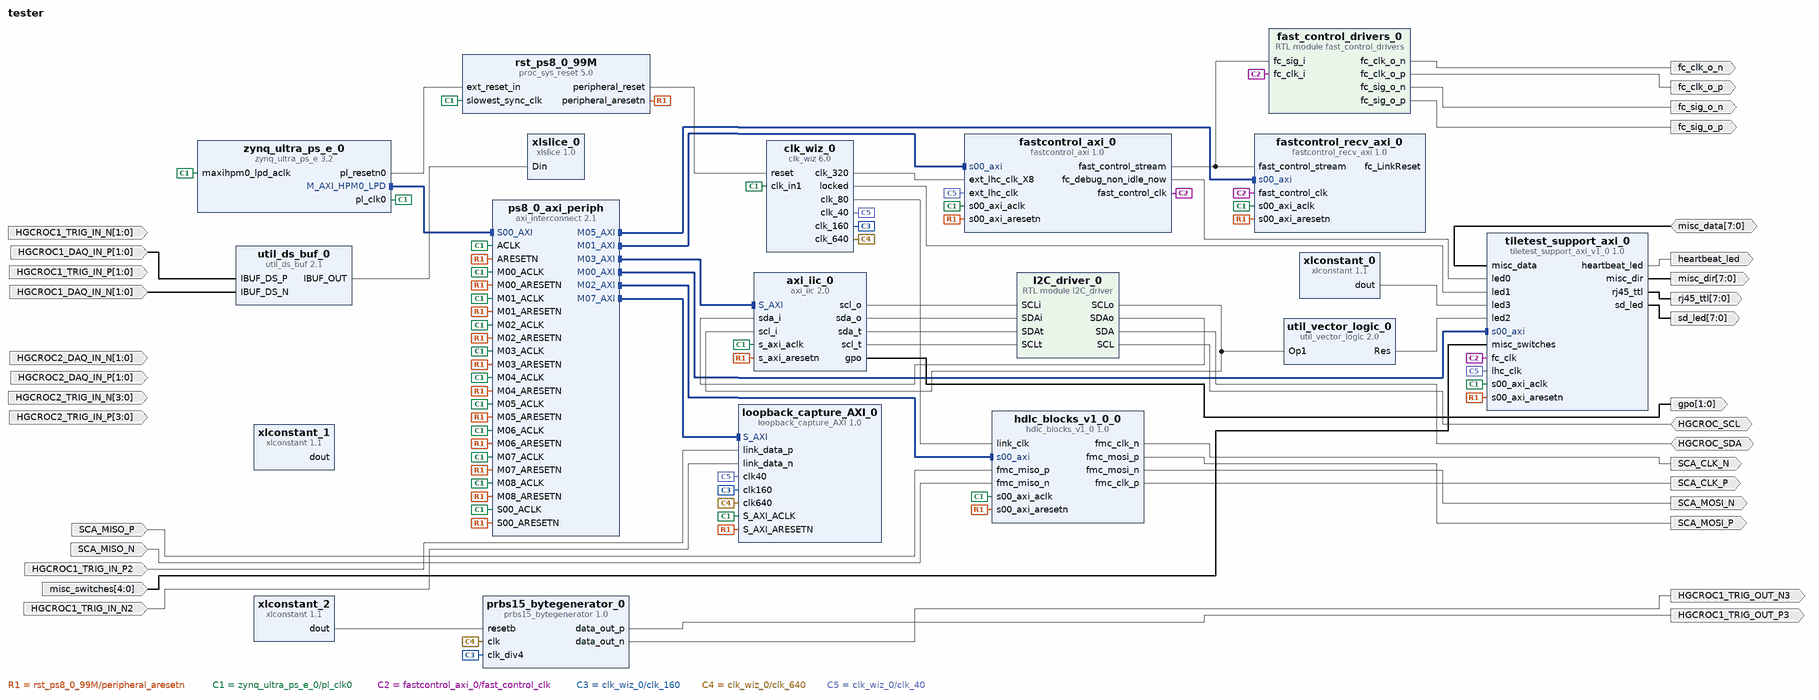
[diagram p0: block diagram of the top level]
# Vivado block design tester, xczu2cg-sfvc784-1-e, Vivado 2018.3
create_bd_design tester

create_bd_port -dir O fc_clk_o_p
create_bd_port -dir O fc_clk_o_n
create_bd_port -dir O fc_sig_o_p
create_bd_port -dir O fc_sig_o_n
create_bd_port -dir O -from 7 -to 0 sd_led
create_bd_port -dir O -from 7 -to 0 misc_dir
create_bd_port -dir IO -from 7 -to 0 misc_data
create_bd_port -dir O -from 7 -to 0 rj45_ttl
create_bd_port -dir O heartbeat_led
create_bd_port -dir I -from 4 -to 0 misc_switches
create_bd_port -dir I SCA_MISO_P
create_bd_port -dir I SCA_MISO_N
create_bd_port -dir O SCA_MOSI_P
create_bd_port -dir O SCA_MOSI_N
create_bd_port -dir O -type clk SCA_CLK_P
create_bd_port -dir O -type clk SCA_CLK_N
create_bd_port -dir IO HGCROC_SDA
create_bd_port -dir O -from 1 -to 0 gpo
create_bd_port -dir IO HGCROC_SCL
create_bd_port -dir I -from 1 -to 0 HGCROC1_DAQ_IN_P
create_bd_port -dir I -from 1 -to 0 HGCROC1_DAQ_IN_N
create_bd_port -dir I HGCROC1_TRIG_IN_P2
create_bd_port -dir I HGCROC1_TRIG_IN_N2
create_bd_port -dir O HGCROC1_TRIG_OUT_P3
create_bd_port -dir O HGCROC1_TRIG_OUT_N3
create_bd_port -dir I -from 1 -to 0 HGCROC1_TRIG_IN_P
create_bd_port -dir I -from 1 -to 0 HGCROC1_TRIG_IN_N
create_bd_port -dir I -from 1 -to 0 HGCROC2_DAQ_IN_P
create_bd_port -dir I -from 1 -to 0 HGCROC2_DAQ_IN_N
create_bd_port -dir I -from 3 -to 0 HGCROC2_TRIG_IN_P
create_bd_port -dir I -from 3 -to 0 HGCROC2_TRIG_IN_N

create_bd_cell -type ip -vlnv xilinx.com:ip:zynq_ultra_ps_e:3.2 zynq_ultra_ps_e_0
set_property -dict [list \
  CONFIG.PSU_BANK_0_IO_STANDARD LVCMOS18 \
  CONFIG.PSU_BANK_1_IO_STANDARD LVCMOS33 \
  CONFIG.PSU_BANK_2_IO_STANDARD LVCMOS18 \
  CONFIG.PSU_BANK_3_IO_STANDARD LVCMOS18 \
  CONFIG.PSU__CRF_APB__DDR_CTRL__FREQMHZ 1200 \
  CONFIG.PSU__CRF_APB__DDR_CTRL__SRCSEL DPLL \
  CONFIG.PSU__CRL_APB__USB3__ENABLE 1 \
  CONFIG.PSU__DDRC__BUS_WIDTH {32 Bit} \
  CONFIG.PSU__DDRC__COMPONENTS Components \
  CONFIG.PSU__DDRC__DEVICE_CAPACITY {8192 MBits} \
  CONFIG.PSU__DDRC__DRAM_WIDTH {16 Bits} \
  CONFIG.PSU__DDRC__ECC Disabled \
  CONFIG.PSU__DDRC__MEMORY_TYPE {DDR 4} \
  CONFIG.PSU__DDRC__SPEED_BIN DDR4_2400P \
  CONFIG.PSU__DDR_HIGH_ADDRESS_GUI_ENABLE 0 \
  CONFIG.PSU__DDR__INTERFACE__FREQMHZ 600.000 \
  CONFIG.PSU__DLL__ISUSED 1 \
  CONFIG.PSU__ENET3__FIFO__ENABLE 0 \
  CONFIG.PSU__ENET3__GRP_MDIO__ENABLE 1 \
  CONFIG.PSU__ENET3__GRP_MDIO__IO {MIO 76 .. 77} \
  CONFIG.PSU__ENET3__PERIPHERAL__ENABLE 1 \
  CONFIG.PSU__ENET3__PERIPHERAL__IO {MIO 64 .. 75} \
  CONFIG.PSU__ENET3__PTP__ENABLE 0 \
  CONFIG.PSU__ENET3__TSU__ENABLE 0 \
  CONFIG.PSU__GEM3_COHERENCY 0 \
  CONFIG.PSU__GEM__TSU__ENABLE 0 \
  CONFIG.PSU__GPIO0_MIO__IO {MIO 0 .. 25} \
  CONFIG.PSU__GPIO0_MIO__PERIPHERAL__ENABLE 1 \
  CONFIG.PSU__I2C0__PERIPHERAL__ENABLE 1 \
  CONFIG.PSU__I2C0__PERIPHERAL__IO {MIO 38 .. 39} \
  CONFIG.PSU__PRESET_APPLIED 1 \
  CONFIG.PSU__PSS_REF_CLK__FREQMHZ 33.33333 \
  CONFIG.PSU__QSPI_COHERENCY 0 \
  CONFIG.PSU__QSPI__GRP_FBCLK__ENABLE 1 \
  CONFIG.PSU__QSPI__GRP_FBCLK__IO {MIO 6} \
  CONFIG.PSU__QSPI__PERIPHERAL__DATA_MODE x4 \
  CONFIG.PSU__QSPI__PERIPHERAL__ENABLE 1 \
  CONFIG.PSU__QSPI__PERIPHERAL__IO {MIO 0 .. 12} \
  CONFIG.PSU__QSPI__PERIPHERAL__MODE {Dual Parallel} \
  CONFIG.PSU__SD0__DATA_TRANSFER_MODE 8Bit \
  CONFIG.PSU__SD0__GRP_POW__ENABLE 1 \
  CONFIG.PSU__SD0__GRP_POW__IO {MIO 23} \
  CONFIG.PSU__SD0__PERIPHERAL__ENABLE 1 \
  CONFIG.PSU__SD0__PERIPHERAL__IO {MIO 13 .. 22} \
  CONFIG.PSU__SD0__RESET__ENABLE 1 \
  CONFIG.PSU__SD0__SLOT_TYPE eMMC \
  CONFIG.PSU__SD1_COHERENCY 0 \
  CONFIG.PSU__SD1__DATA_TRANSFER_MODE 4Bit \
  CONFIG.PSU__SD1__GRP_CD__ENABLE 0 \
  CONFIG.PSU__SD1__GRP_POW__ENABLE 0 \
  CONFIG.PSU__SD1__GRP_WP__ENABLE 0 \
  CONFIG.PSU__SD1__PERIPHERAL__ENABLE 1 \
  CONFIG.PSU__SD1__PERIPHERAL__IO {MIO 46 .. 51} \
  CONFIG.PSU__SD1__SLOT_TYPE {SD 2.0} \
  CONFIG.PSU__SWDT0__CLOCK__ENABLE 0 \
  CONFIG.PSU__SWDT0__PERIPHERAL__ENABLE 1 \
  CONFIG.PSU__SWDT0__RESET__ENABLE 0 \
  CONFIG.PSU__SWDT1__CLOCK__ENABLE 0 \
  CONFIG.PSU__SWDT1__PERIPHERAL__ENABLE 1 \
  CONFIG.PSU__SWDT1__RESET__ENABLE 0 \
  CONFIG.PSU__TSU__BUFG_PORT_PAIR 0 \
  CONFIG.PSU__TTC0__CLOCK__ENABLE 0 \
  CONFIG.PSU__TTC0__PERIPHERAL__ENABLE 1 \
  CONFIG.PSU__TTC0__WAVEOUT__ENABLE 0 \
  CONFIG.PSU__TTC1__CLOCK__ENABLE 0 \
  CONFIG.PSU__TTC1__PERIPHERAL__ENABLE 1 \
  CONFIG.PSU__TTC1__WAVEOUT__ENABLE 0 \
  CONFIG.PSU__TTC2__CLOCK__ENABLE 0 \
  CONFIG.PSU__TTC2__PERIPHERAL__ENABLE 1 \
  CONFIG.PSU__TTC2__WAVEOUT__ENABLE 0 \
  CONFIG.PSU__TTC3__CLOCK__ENABLE 0 \
  CONFIG.PSU__TTC3__PERIPHERAL__ENABLE 1 \
  CONFIG.PSU__TTC3__WAVEOUT__ENABLE 0 \
  CONFIG.PSU__UART0__BAUD_RATE 115200 \
  CONFIG.PSU__UART0__MODEM__ENABLE 0 \
  CONFIG.PSU__UART0__PERIPHERAL__ENABLE 1 \
  CONFIG.PSU__UART0__PERIPHERAL__IO {MIO 30 .. 31} \
  CONFIG.PSU__USB0_COHERENCY 0 \
  CONFIG.PSU__USB0__PERIPHERAL__ENABLE 1 \
  CONFIG.PSU__USB0__PERIPHERAL__IO {MIO 52 .. 63} \
  CONFIG.PSU__USB0__REF_CLK_FREQ 100 \
  CONFIG.PSU__USB0__REF_CLK_SEL {Ref Clk3} \
  CONFIG.PSU__USB2_0__EMIO__ENABLE 0 \
  CONFIG.PSU__USB3_0__EMIO__ENABLE 0 \
  CONFIG.PSU__USB3_0__PERIPHERAL__ENABLE 1 \
  CONFIG.PSU__USB3_0__PERIPHERAL__IO {GT Lane0} \
  CONFIG.PSU__USB__RESET__MODE {Boot Pin} \
  CONFIG.PSU__USB__RESET__POLARITY {Active Low} \
  CONFIG.SUBPRESET1 Custom \
] [get_bd_cells zynq_ultra_ps_e_0]
# 86 more settings of zynq_ultra_ps_e_0 are not shown: defaults, MIO pin electricals, DDR timing, and values the tool derives
create_bd_cell -type ip -vlnv xilinx.com:ip:axi_interconnect:2.1 ps8_0_axi_periph
set_property -dict {CONFIG.NUM_MI 9} [get_bd_cells ps8_0_axi_periph]
create_bd_cell -type ip -vlnv xilinx.com:ip:xlconstant:1.1 xlconstant_0
set_property -dict {CONFIG.CONST_VAL 0} [get_bd_cells xlconstant_0]
create_bd_cell -type module -reference fast_control_drivers fast_control_drivers_0
create_bd_cell -type ip -vlnv xilinx.com:ip:util_vector_logic:2.0 util_vector_logic_0
set_property -dict {CONFIG.C_OPERATION not CONFIG.C_SIZE 1} [get_bd_cells util_vector_logic_0]
create_bd_cell -type module -reference I2C_driver I2C_driver_0
create_bd_cell -type ip -vlnv xilinx.com:ip:axi_iic:2.0 axi_iic_0
set_property -dict {CONFIG.C_DEFAULT_VALUE 0x03 CONFIG.C_GPO_WIDTH 2} [get_bd_cells axi_iic_0]
create_bd_cell -type ip -vlnv xilinx.com:ip:clk_wiz:6.0 clk_wiz_0
set_property -dict [list \
  CONFIG.CLKOUT1_JITTER 161.073 \
  CONFIG.CLKOUT1_PHASE_ERROR 320.727 \
  CONFIG.CLKOUT1_REQUESTED_OUT_FREQ 320 \
  CONFIG.CLKOUT2_JITTER 212.577 \
  CONFIG.CLKOUT2_PHASE_ERROR 320.727 \
  CONFIG.CLKOUT2_REQUESTED_OUT_FREQ 40 \
  CONFIG.CLKOUT2_USED true \
  CONFIG.CLKOUT3_JITTER 193.445 \
  CONFIG.CLKOUT3_PHASE_ERROR 320.727 \
  CONFIG.CLKOUT3_REQUESTED_OUT_FREQ 80 \
  CONFIG.CLKOUT3_USED true \
  CONFIG.CLKOUT4_JITTER 176.430 \
  CONFIG.CLKOUT4_PHASE_ERROR 320.727 \
  CONFIG.CLKOUT4_REQUESTED_OUT_FREQ 160 \
  CONFIG.CLKOUT4_USED true \
  CONFIG.CLKOUT5_JITTER 147.227 \
  CONFIG.CLKOUT5_PHASE_ERROR 320.727 \
  CONFIG.CLKOUT5_REQUESTED_OUT_FREQ 640 \
  CONFIG.CLKOUT5_USED true \
  CONFIG.CLK_OUT1_PORT clk_320 \
  CONFIG.CLK_OUT2_PORT clk_40 \
  CONFIG.CLK_OUT3_PORT clk_80 \
  CONFIG.CLK_OUT4_PORT clk_160 \
  CONFIG.CLK_OUT5_PORT clk_640 \
  CONFIG.MMCM_CLKFBOUT_MULT_F 64.000 \
  CONFIG.MMCM_CLKIN1_PERIOD 10.000 \
  CONFIG.MMCM_CLKIN2_PERIOD 10.000 \
  CONFIG.MMCM_CLKOUT0_DIVIDE_F 4.000 \
  CONFIG.MMCM_CLKOUT1_DIVIDE 32 \
  CONFIG.MMCM_CLKOUT2_DIVIDE 16 \
  CONFIG.MMCM_CLKOUT3_DIVIDE 8 \
  CONFIG.MMCM_CLKOUT4_DIVIDE 2 \
  CONFIG.MMCM_DIVCLK_DIVIDE 5 \
  CONFIG.NUM_OUT_CLKS 5 \
] [get_bd_cells clk_wiz_0]
create_bd_cell -type ip -vlnv xilinx.com:ip:proc_sys_reset:5.0 rst_ps8_0_99M
create_bd_cell -type ip -vlnv xilinx.com:ip:util_ds_buf:2.1 util_ds_buf_0
set_property -dict {CONFIG.C_SIZE 2} [get_bd_cells util_ds_buf_0]
create_bd_cell -type ip -vlnv xilinx.com:user:hdlc_blocks_v1_0:1.0 hdlc_blocks_v1_0_0
create_bd_cell -type ip -vlnv xilinx.com:user:tiletest_support_axi_v1_0:1.0 tiletest_support_axi_0
create_bd_cell -type ip -vlnv xilinx.com:user:fastcontrol_axi:1.0 fastcontrol_axi_0
create_bd_cell -type ip -vlnv xilinx.com:ip:xlconstant:1.1 xlconstant_1
set_property -dict {CONFIG.CONST_VAL 0} [get_bd_cells xlconstant_1]
create_bd_cell -type ip -vlnv xilinx.com:ip:xlslice:1.0 xlslice_0
set_property -dict {CONFIG.DIN_FROM 0 CONFIG.DIN_TO 0 CONFIG.DIN_WIDTH 2} [get_bd_cells xlslice_0]
create_bd_cell -type ip -vlnv xilinx.com:user:fastcontrol_recv_axi:1.0 fastcontrol_recv_axi_0
create_bd_cell -type ip -vlnv user.org:user:prbs15_bytegenerator:1.0 prbs15_bytegenerator_0
create_bd_cell -type ip -vlnv xilinx.com:ip:xlconstant:1.1 xlconstant_2
create_bd_cell -type ip -vlnv user.org:user:loopback_capture_AXI:1.0 loopback_capture_AXI_0

# ---- connections ----

connect_bd_intf_net [get_bd_intf_pins ps8_0_axi_periph/M02_AXI] [get_bd_intf_pins hdlc_blocks_v1_0_0/s00_axi]
connect_bd_intf_net [get_bd_intf_pins ps8_0_axi_periph/M03_AXI] [get_bd_intf_pins axi_iic_0/S_AXI]
connect_bd_intf_net [get_bd_intf_pins ps8_0_axi_periph/M01_AXI] [get_bd_intf_pins fastcontrol_axi_0/s00_axi]
connect_bd_intf_net [get_bd_intf_pins ps8_0_axi_periph/M07_AXI] [get_bd_intf_pins loopback_capture_AXI_0/S_AXI]
connect_bd_intf_net [get_bd_intf_pins ps8_0_axi_periph/M05_AXI] [get_bd_intf_pins fastcontrol_recv_axi_0/s00_axi]
connect_bd_intf_net [get_bd_intf_pins ps8_0_axi_periph/M00_AXI] [get_bd_intf_pins tiletest_support_axi_0/s00_axi]
connect_bd_intf_net [get_bd_intf_pins zynq_ultra_ps_e_0/M_AXI_HPM0_LPD] [get_bd_intf_pins ps8_0_axi_periph/S00_AXI]
connect_bd_net [get_bd_pins zynq_ultra_ps_e_0/pl_resetn0] [get_bd_pins rst_ps8_0_99M/ext_reset_in]
connect_bd_net [get_bd_pins rst_ps8_0_99M/peripheral_aresetn] \
  [get_bd_pins ps8_0_axi_periph/S00_ARESETN] [get_bd_pins ps8_0_axi_periph/M00_ARESETN] \
  [get_bd_pins ps8_0_axi_periph/ARESETN] [get_bd_pins ps8_0_axi_periph/M01_ARESETN] \
  [get_bd_pins ps8_0_axi_periph/M02_ARESETN] [get_bd_pins ps8_0_axi_periph/M03_ARESETN] [get_bd_pins axi_iic_0/s_axi_aresetn] \
  [get_bd_pins hdlc_blocks_v1_0_0/s00_axi_aresetn] [get_bd_pins tiletest_support_axi_0/s00_axi_aresetn] \
  [get_bd_pins fastcontrol_axi_0/s00_axi_aresetn] [get_bd_pins ps8_0_axi_periph/M04_ARESETN] \
  [get_bd_pins ps8_0_axi_periph/M05_ARESETN] [get_bd_pins ps8_0_axi_periph/M06_ARESETN] \
  [get_bd_pins fastcontrol_recv_axi_0/s00_axi_aresetn] [get_bd_pins ps8_0_axi_periph/M07_ARESETN] \
  [get_bd_pins ps8_0_axi_periph/M08_ARESETN] [get_bd_pins loopback_capture_AXI_0/S_AXI_ARESETN]
connect_bd_net [get_bd_pins fast_control_drivers_0/fc_clk_o_p] [get_bd_ports fc_clk_o_p]
connect_bd_net [get_bd_pins fast_control_drivers_0/fc_clk_o_n] [get_bd_ports fc_clk_o_n]
connect_bd_net [get_bd_pins fast_control_drivers_0/fc_sig_o_p] [get_bd_ports fc_sig_o_p]
connect_bd_net [get_bd_pins fast_control_drivers_0/fc_sig_o_n] [get_bd_ports fc_sig_o_n]
connect_bd_net [get_bd_pins zynq_ultra_ps_e_0/pl_clk0] \
  [get_bd_pins zynq_ultra_ps_e_0/maxihpm0_lpd_aclk] [get_bd_pins ps8_0_axi_periph/S00_ACLK] \
  [get_bd_pins ps8_0_axi_periph/M00_ACLK] [get_bd_pins ps8_0_axi_periph/ACLK] [get_bd_pins ps8_0_axi_periph/M01_ACLK] \
  [get_bd_pins ps8_0_axi_periph/M02_ACLK] [get_bd_pins ps8_0_axi_periph/M03_ACLK] [get_bd_pins axi_iic_0/s_axi_aclk] \
  [get_bd_pins clk_wiz_0/clk_in1] [get_bd_pins rst_ps8_0_99M/slowest_sync_clk] [get_bd_pins hdlc_blocks_v1_0_0/s00_axi_aclk] \
  [get_bd_pins tiletest_support_axi_0/s00_axi_aclk] [get_bd_pins fastcontrol_axi_0/s00_axi_aclk] \
  [get_bd_pins ps8_0_axi_periph/M04_ACLK] [get_bd_pins ps8_0_axi_periph/M05_ACLK] [get_bd_pins ps8_0_axi_periph/M06_ACLK] \
  [get_bd_pins fastcontrol_recv_axi_0/s00_axi_aclk] [get_bd_pins ps8_0_axi_periph/M07_ACLK] \
  [get_bd_pins ps8_0_axi_periph/M08_ACLK] [get_bd_pins loopback_capture_AXI_0/S_AXI_ACLK]
connect_bd_net [get_bd_pins rst_ps8_0_99M/peripheral_reset] [get_bd_pins clk_wiz_0/reset]
connect_bd_net [get_bd_pins clk_wiz_0/clk_80] [get_bd_pins hdlc_blocks_v1_0_0/link_clk]
connect_bd_net [get_bd_ports SCA_MISO_P] [get_bd_pins hdlc_blocks_v1_0_0/fmc_miso_p]
connect_bd_net [get_bd_ports SCA_MISO_N] [get_bd_pins hdlc_blocks_v1_0_0/fmc_miso_n]
connect_bd_net -net I2C_driver_0_SCLo [get_bd_pins axi_iic_0/scl_o] [get_bd_pins I2C_driver_0/SCLi]
connect_bd_net [get_bd_pins I2C_driver_0/SDAo] [get_bd_pins axi_iic_0/sda_i]
connect_bd_net [get_bd_pins axi_iic_0/sda_o] [get_bd_pins I2C_driver_0/SDAi]
connect_bd_net [get_bd_pins axi_iic_0/sda_t] [get_bd_pins I2C_driver_0/SDAt]
connect_bd_net [get_bd_ports HGCROC_SDA] [get_bd_pins I2C_driver_0/SDA]
connect_bd_net [get_bd_pins axi_iic_0/gpo] [get_bd_ports gpo]
connect_bd_net [get_bd_ports HGCROC_SCL] [get_bd_pins I2C_driver_0/SCL]
connect_bd_net [get_bd_pins I2C_driver_0/SCLo] [get_bd_pins util_vector_logic_0/Op1] [get_bd_pins axi_iic_0/scl_i]
connect_bd_net [get_bd_pins axi_iic_0/scl_t] [get_bd_pins I2C_driver_0/SCLt]
connect_bd_net [get_bd_ports HGCROC1_DAQ_IN_P] [get_bd_pins util_ds_buf_0/IBUF_DS_P]
connect_bd_net [get_bd_ports HGCROC1_DAQ_IN_N] [get_bd_pins util_ds_buf_0/IBUF_DS_N]
connect_bd_net [get_bd_pins hdlc_blocks_v1_0_0/fmc_mosi_p] [get_bd_ports SCA_MOSI_P]
connect_bd_net [get_bd_pins hdlc_blocks_v1_0_0/fmc_mosi_n] [get_bd_ports SCA_MOSI_N]
connect_bd_net [get_bd_pins hdlc_blocks_v1_0_0/fmc_clk_p] [get_bd_ports SCA_CLK_P]
connect_bd_net [get_bd_pins hdlc_blocks_v1_0_0/fmc_clk_n] [get_bd_ports SCA_CLK_N]
connect_bd_net [get_bd_pins tiletest_support_axi_0/sd_led] [get_bd_ports sd_led]
connect_bd_net [get_bd_pins tiletest_support_axi_0/misc_dir] [get_bd_ports misc_dir]
connect_bd_net [get_bd_ports misc_data] [get_bd_pins tiletest_support_axi_0/misc_data]
connect_bd_net [get_bd_pins tiletest_support_axi_0/heartbeat_led] [get_bd_ports heartbeat_led]
connect_bd_net [get_bd_pins tiletest_support_axi_0/rj45_ttl] [get_bd_ports rj45_ttl]
connect_bd_net [get_bd_pins xlconstant_0/dout] [get_bd_pins tiletest_support_axi_0/led3]
connect_bd_net [get_bd_pins util_vector_logic_0/Res] [get_bd_pins tiletest_support_axi_0/led2]
connect_bd_net [get_bd_pins clk_wiz_0/locked] [get_bd_pins tiletest_support_axi_0/led1]
connect_bd_net [get_bd_pins fastcontrol_axi_0/fc_debug_non_idle_now] [get_bd_pins tiletest_support_axi_0/led0]
connect_bd_net [get_bd_pins fastcontrol_axi_0/fast_control_clk] \
  [get_bd_pins fast_control_drivers_0/fc_clk_i] [get_bd_pins tiletest_support_axi_0/fc_clk] \
  [get_bd_pins fastcontrol_recv_axi_0/fast_control_clk]
connect_bd_net [get_bd_pins fastcontrol_axi_0/fast_control_stream] \
  [get_bd_pins fast_control_drivers_0/fc_sig_i] [get_bd_pins fastcontrol_recv_axi_0/fast_control_stream]
connect_bd_net [get_bd_pins clk_wiz_0/clk_320] [get_bd_pins fastcontrol_axi_0/ext_lhc_clk_X8]
connect_bd_net [get_bd_ports misc_switches] [get_bd_pins tiletest_support_axi_0/misc_switches]
connect_bd_net [get_bd_pins clk_wiz_0/clk_160] [get_bd_pins prbs15_bytegenerator_0/clk_div4] [get_bd_pins loopback_capture_AXI_0/clk160]
connect_bd_net [get_bd_pins clk_wiz_0/clk_640] [get_bd_pins prbs15_bytegenerator_0/clk] [get_bd_pins loopback_capture_AXI_0/clk640]
# net fastcontrol_recv_axi_0_fc_LinkReset has one end: fastcontrol_recv_axi_0/fc_LinkReset
# net xlconstant_1_dout has one end: xlconstant_1/dout
connect_bd_net [get_bd_pins util_ds_buf_0/IBUF_OUT] [get_bd_pins xlslice_0/Din]
connect_bd_net [get_bd_pins clk_wiz_0/clk_40] \
  [get_bd_pins fastcontrol_axi_0/ext_lhc_clk] [get_bd_pins tiletest_support_axi_0/lhc_clk] \
  [get_bd_pins loopback_capture_AXI_0/clk40]
connect_bd_net -net HGCROC1_TRIG_IN_P2_1 [get_bd_ports HGCROC1_TRIG_IN_P2] [get_bd_pins loopback_capture_AXI_0/link_data_p]
connect_bd_net -net HGCROC1_TRIG_IN_N2_1 [get_bd_ports HGCROC1_TRIG_IN_N2] [get_bd_pins loopback_capture_AXI_0/link_data_n]
connect_bd_net [get_bd_pins prbs15_bytegenerator_0/data_out_p] [get_bd_ports HGCROC1_TRIG_OUT_P3]
connect_bd_net [get_bd_pins prbs15_bytegenerator_0/data_out_n] [get_bd_ports HGCROC1_TRIG_OUT_N3]
connect_bd_net [get_bd_pins xlconstant_2/dout] [get_bd_pins prbs15_bytegenerator_0/resetb]

# ---- address map ----
assign_bd_address -offset 0x0080000000 -range 4K -target_address_space [get_bd_addr_spaces zynq_ultra_ps_e_0/Data] [get_bd_addr_segs hdlc_blocks_v1_0_0/s00_axi/reg0]
assign_bd_address -offset 0x0080001000 -range 4K -target_address_space [get_bd_addr_spaces zynq_ultra_ps_e_0/Data] [get_bd_addr_segs fastcontrol_axi_0/s00_axi/reg0]
assign_bd_address -offset 0x0080002000 -range 4K -target_address_space [get_bd_addr_spaces zynq_ultra_ps_e_0/Data] [get_bd_addr_segs tiletest_support_axi_0/s00_axi/reg0]
assign_bd_address -offset 0x0080003000 -range 4K -target_address_space [get_bd_addr_spaces zynq_ultra_ps_e_0/Data] [get_bd_addr_segs axi_iic_0/S_AXI/Reg]
assign_bd_address -offset 0x0080004000 -range 4K -target_address_space [get_bd_addr_spaces zynq_ultra_ps_e_0/Data] [get_bd_addr_segs loopback_capture_AXI_0/S_AXI/reg0]
assign_bd_address -offset 0x0080005000 -range 4K -target_address_space [get_bd_addr_spaces zynq_ultra_ps_e_0/Data] [get_bd_addr_segs fastcontrol_recv_axi_0/s00_axi/reg0]

validate_bd_design
save_bd_design
